# EasyEDA Pro project ProProject_Barrier Gate.epro

# Schematic Schematic1
Create Date: 2024-09-24; Page Name: P1; Project Name: Barrier Gate; Schematic Name: Schematic1; Update Date: 2024-09-28; Company: EasyEDA.com; Drawn: EasyEDA; Page Size: A4; Part Number: JLCPCB-002; Reviewed: EasyEDA; Version: V0.1
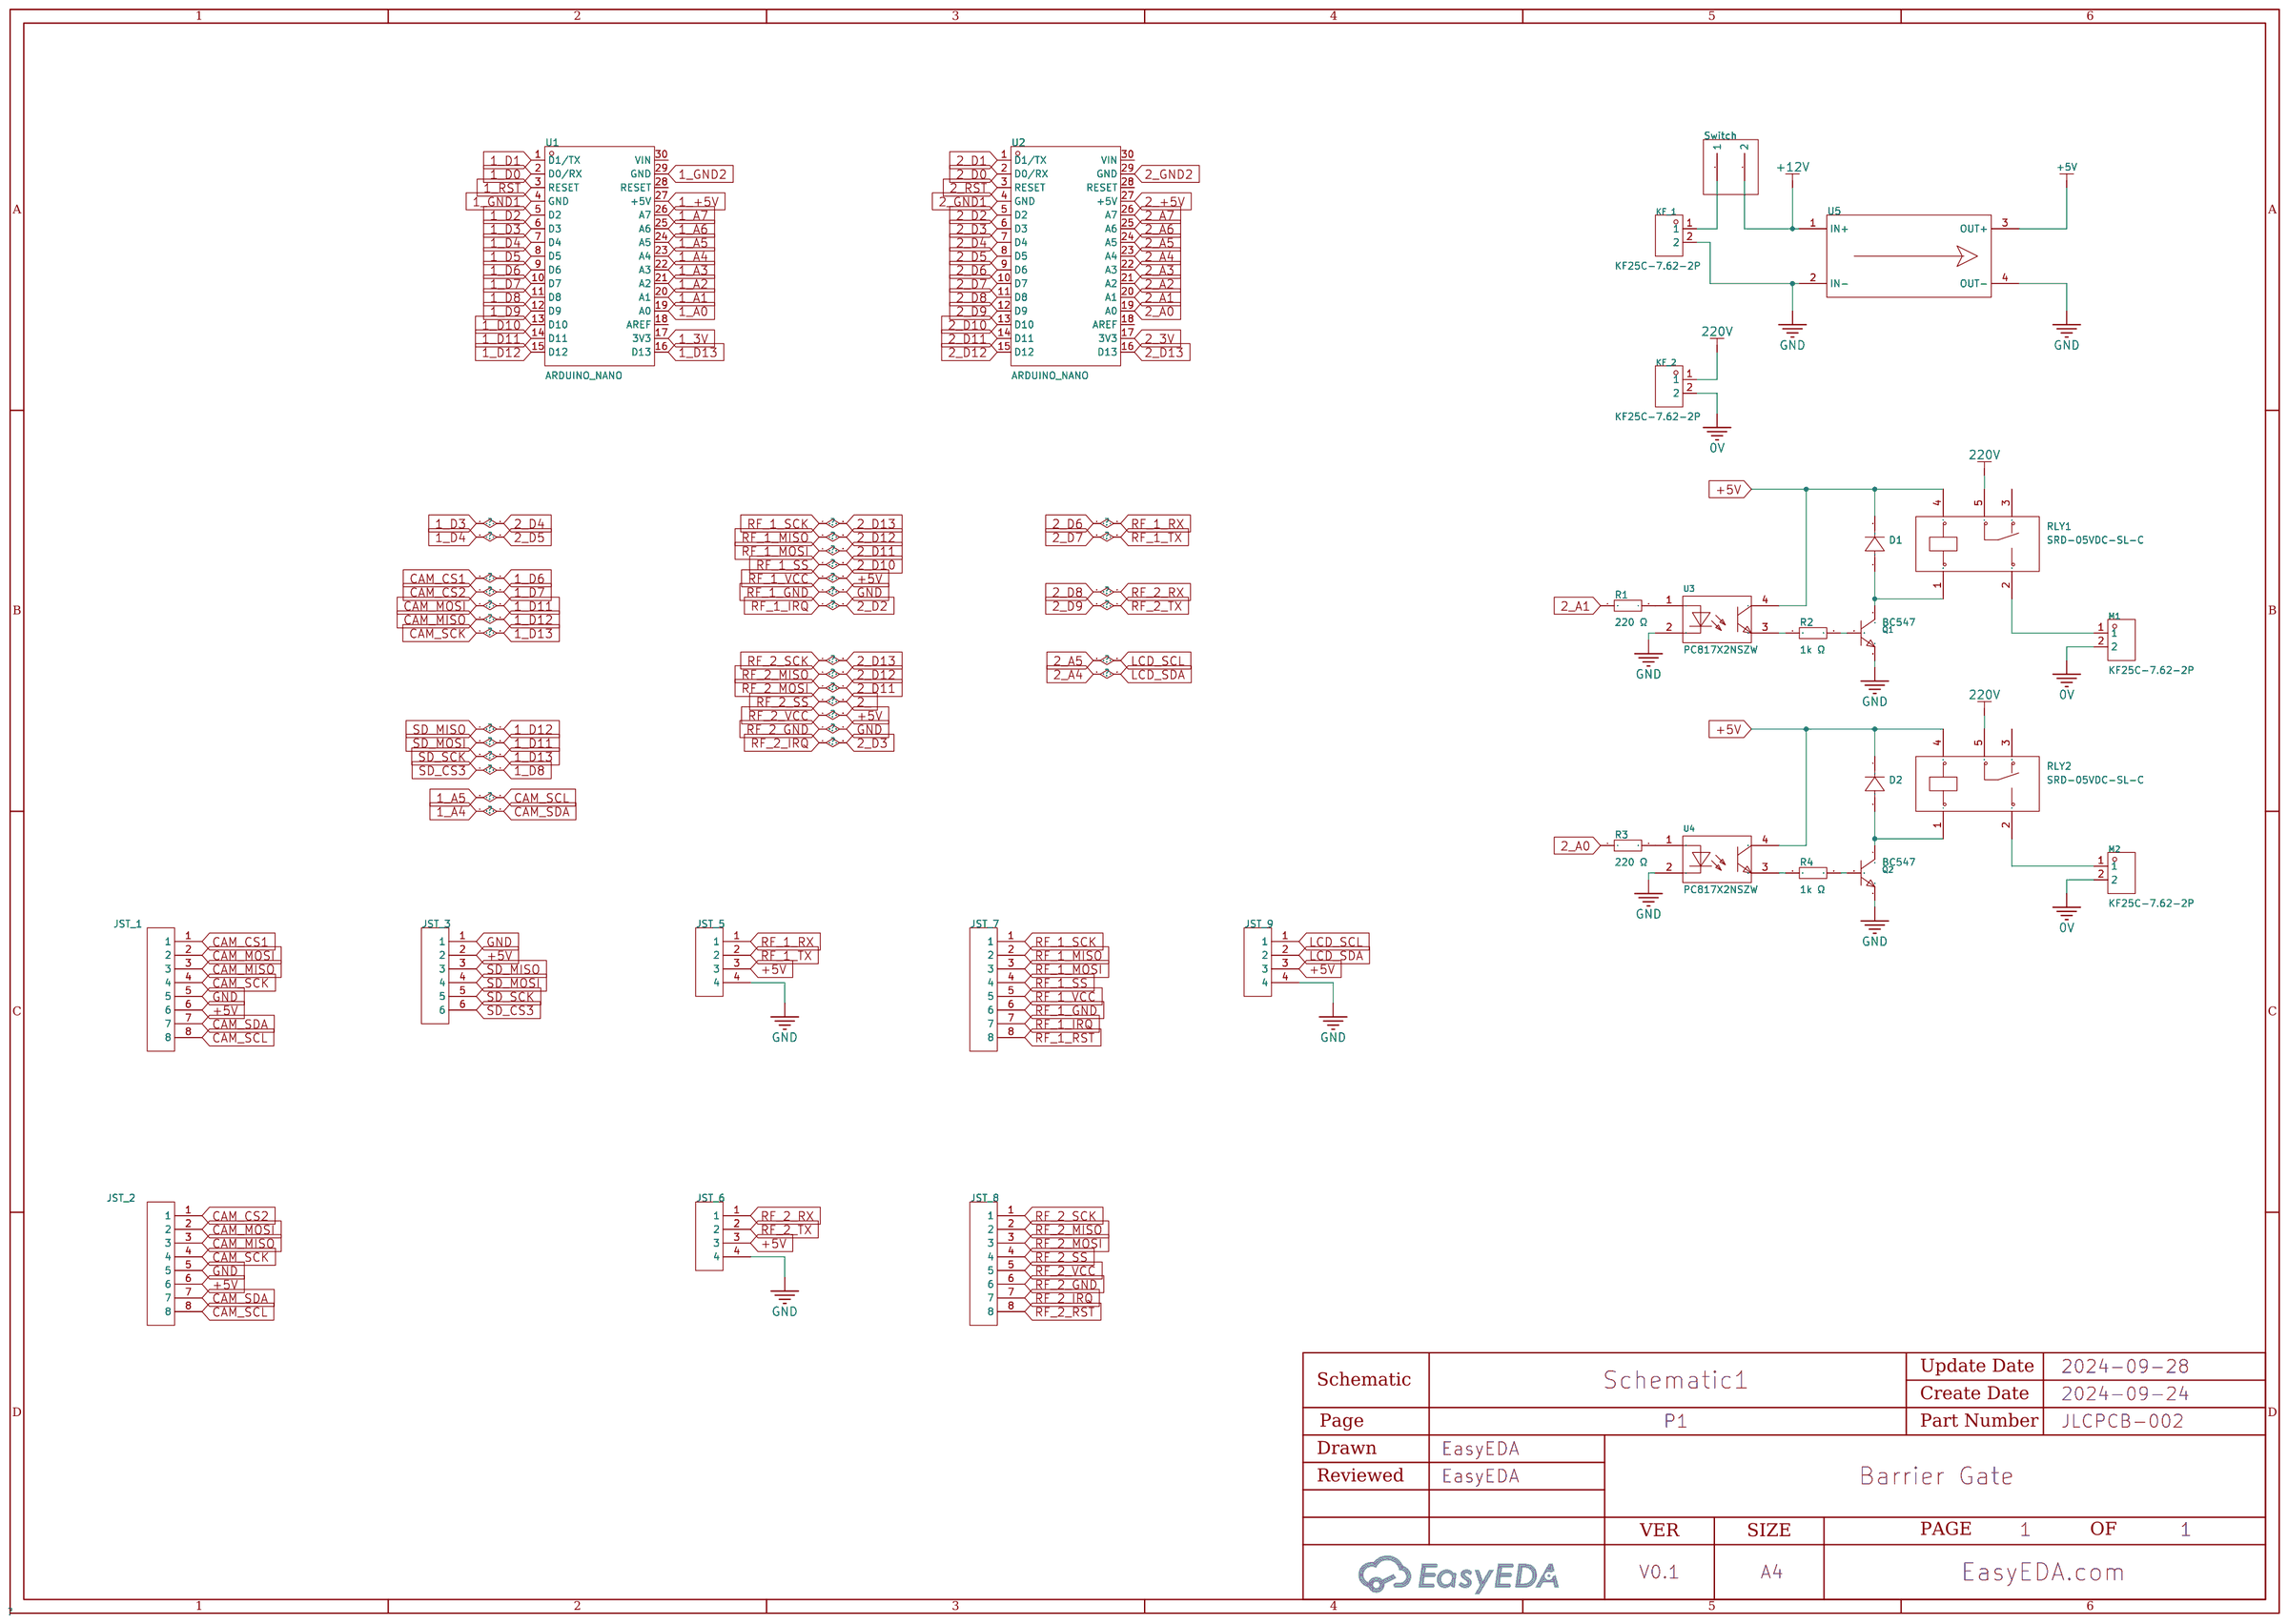
[diagram p0: schematic sheet]

## Parts
D1  -  [DO-41_BD2.4-L4.7-P8.70-D0.9-RD]
D2  -  [DO-41_BD2.4-L4.7-P8.70-D0.9-RD]
JST_1  -  [JST XH2.54 8 PIN]
JST_2  -  [JST XH2.54 8 PIN]
JST_3  -  [JST XH2.54 6 PIN]
JST_5  -  [JST XH2.54 4 PIN]
JST_6  -  [JST XH2.54 4 PIN]
JST_7  -  [JST XH2.54 8 PIN]
JST_8  -  [JST XH2.54 8 PIN]
JST_9  -  [JST XH2.54 4 PIN]
KF_1  KF25C-7.62-2P  [CONN-TH_KF25C-7.62-2P]
KF_2  KF25C-7.62-2P  [CONN-TH_KF25C-7.62-2P]
M1  KF25C-7.62-2P  [CONN-TH_KF25C-7.62-2P]
M2  KF25C-7.62-2P  [CONN-TH_KF25C-7.62-2P]
Q1  BC547  [TO-92-3_L4.9-W3.7-P1.27-L]
Q2  BC547  [TO-92-3_L4.9-W3.7-P1.27-L]
R1  220 Ω  [R_AXIAL-0.4]
R2  1k Ω  [R_AXIAL-0.4]
R3  220 Ω  [R_AXIAL-0.4]
R4  1k Ω  [R_AXIAL-0.4]
RLY1  SRD-05VDC-SL-C  [RELAY-TH_SRD-XXVDC-XL-C]
RLY2  SRD-05VDC-SL-C  [RELAY-TH_SRD-XXVDC-XL-C]
Switch  -  [JST XH2.54 2 PIN]
U1  ARDUINO_NANO  [COMM-TH_ARDUINO_NANO]
U2  ARDUINO_NANO  [COMM-TH_ARDUINO_NANO]
U3  PC817X2NSZW  [DIP-4_L6.4-W4.6-P2.54-LS7.6-BL]
U4  PC817X2NSZW  [DIP-4_L6.4-W4.6-P2.54-LS7.6-BL]
U5  -  [LM2596]

## Library data of the parts
D1 D2 = 1N4007: Supplier Footprint: DO-41
JST_1 JST_2 JST_7 JST_8 = JST XH2.54 8 PIN
JST_3 = JST XH2.54 6 PIN
JST_5 JST_6 JST_9 = JST XH2.54 4 PIN
KF_1 KF_2 M1 M2 = KF25C-7.62-2P: Barrier Type:两面 Pitch:7.62mm Structure:1x2P Mounting Style:直针 Pin Location:中脚 Number of Pins:2P Number of Rows:1 Current Rating (Max):24A Voltage Rating (Max):250V Wire Gauge - AWG:12~22 Wire Gauge - mm2:2.5 Operating Temperature Range:-40℃~+105℃ Operatin; LCSC Part Name: 7.62mm 1x2P 每排P数:2 排数:1 直针 中脚; Supplier Part: C707361; Manufacturer: KEFA(科发); Supplier Footprint: 插件,P=7.62mm; JLCPCB Part Class: Extended Part; Datasheet: https://atta.szlcsc.com/upload/public/pdf/source/20230331/03BB12528491092C95308D78C6DEF1DF.pdf; Supplier: LCSC; Barrier Type: 两面; Pitch: 7.62mm; Structure: 1x2P; Mounting Style: 直针; Pin Location: 中脚; Number of Pins: 2P; Number of Rows: 1; Current Rating (Max): 24A; Voltage Rating (Max): 250V; Wire Gauge - AWG: 12~22; Wire Gauge - mm2: 2.5; Operating Temperature Range: -40℃~+105℃; Color: Black; Number of PINs Per Row: 2
Q1 Q2 = BC547B: Transistor Type: Collector Current (Ic): Collector-Emitter Breakdown Voltage (Vceo): Power Dissipation (Pd): DC Current Gain (hFE@Ic,Vce):200@2mA,5V DC Current Gain (hFE@Ic,Vce):200@2mA,5V Transition Frequency (fT):150MHz Collector Cut-Off Current (Icbo):; LCSC Part Name: NPN 电流:100mA 耐压:45V; Supplier Part: C713613; Manufacturer: LGE(鲁光); Supplier Footprint: TO-92-3; JLCPCB Part Class: Extended Part; Datasheet: https://atta.szlcsc.com/upload/public/pdf/source/20200731/C713612_A87215DC84F647A4351B6D1248DC2A9A.pdf; Supplier: LCSC; DC Current Gain (hFE@Ic,Vce): 200@2mA,5V; Transition Frequency (fT): 150MHz; Collector Cut-Off Current (Icbo): 100nA; Collector-Emitter Saturation Voltage (VCE(sat)@Ic,Ib): 300mV@100mA,5mA
R1-R4 = Res_AXIAL-1/4W: Supplier Footprint: Through
RLY1 RLY2 = SRD-05VDC-SL-C: Coil Voltage:5V Contact Form:一组转换:1C(SPDT-转换) Pin Number:5 Contact Rating:- Maximum Switching Voltage:250V@AC Coil Rated Power:360mW Maximum Switching Current:15A Coil Type:无极性-单线圈 Coil Resistance:70Ω Contact Resistance:100mΩ Operate Time:10ms Release Tim; LCSC Part Name: 蓝色; Supplier Part: C35449; Manufacturer: 松乐; Supplier Footprint: 插件,15.6x19.2mm; JLCPCB Part Class: Extended Part; Datasheet: https://atta.szlcsc.com/upload/public/pdf/source/20200305/C490149_C96E4098A3B1FFB377D5AD2E40B7C2A8.pdf; Supplier: LCSC; Coil Voltage: 5V; Contact Form: 一组转换:1C(SPDT-转换); Pin Number: 5; Maximum Switching Voltage: 250V@AC; Coil Rated Power: 360mW; Maximum Switching Current: 15A; Coil Type: 无极性-单线圈; Coil Resistance: 70Ω; Contact Resistance: 100mΩ; Operate Time: 10ms; Release Time: 10ms
Switch = JST XH2.54 2 PIN
U1 U2 = ARDUINO_NANO: Supplier Part: C9900017879; Supplier Footprint: 插件; JLCPCB Part Class: Extended Part; Supplier: LCSC
U3 U4 = PC817X2NSZW: LCSC Part Name: PC817B  (B档) 老版; Supplier Part: C5350; Manufacturer: SHARP(夏普); Supplier Footprint: DIP-4; JLCPCB Part Class: Extended Part; Datasheet: https://atta.szlcsc.com/upload/public/pdf/source/20170919/C5350_1505799680836977608.pdf; Supplier: LCSC
U5 = LM2596

## Nets
0V: KF_2.2 M1.2 M2.2
220V: KF_2.1 RLY1.5 RLY2.5
+5V: D1.1(K) D2.1(K) JST_1.6 JST_2.6 JST_3.2 JST_5.3 JST_6.3 JST_7.5 JST_8.5 JST_9.3 RLY1.4 RLY2.4 U3.4 U4.4 U5.3(OUT+)
+12V: Switch.2 U5.1(IN+)
GND: JST_1.5 JST_2.5 JST_3.1 JST_5.4 JST_6.4 JST_7.6 JST_8.6 JST_9.4 KF_1.2 Q1.3(E) Q2.3(E) U3.2 U4.2 U5.2(IN-) U5.4(OUT-)
1_3V: U1.17(3V3)
1_+5V: U1.27(+5V)
1_A0: U1.19(A0)
1_A1: U1.20(A1)
1_A2: U1.21(A2)
1_A3: U1.22(A3)
1_A4: JST_1.7 JST_2.7 U1.23(A4)
1_A5: JST_1.8 JST_2.8 U1.24(A5)
1_A6: U1.25(A6)
1_A7: U1.26(A7)
1_D0: U1.2(D0/RX)
1_D1: U1.1(D1/TX)
1_D2: U1.5(D2)
1_D3: U1.6(D3) U2.7(D4)
1_D4: U1.7(D4) U2.8(D5)
1_D5: U1.8(D5)
1_D6: JST_1.1 U1.9(D6)
1_D7: JST_2.1 U1.10(D7)
1_D8: JST_3.6 U1.11(D8)
1_D9: U1.12(D9)
1_D10: U1.13(D10)
1_D11: JST_1.2 JST_2.2 JST_3.4 U1.14(D11)
1_D12: JST_1.3 JST_2.3 JST_3.3 U1.15(D12)
1_D13: JST_1.4 JST_2.4 JST_3.5 U1.16(D13)
1_GND1: U1.4(GND)
1_GND2: U1.29(GND)
1_RST: U1.3(RESET)
2_: JST_8.4
2_3V: U2.17(3V3)
2_+5V: U2.27(+5V)
2_A0: R3.1 U2.19(A0)
2_A1: R1.1 U2.20(A1)
2_A2: U2.21(A2)
2_A3: U2.22(A3)
2_A4: JST_9.2 U2.23(A4)
2_A5: JST_9.1 U2.24(A5)
2_A6: U2.25(A6)
2_A7: U2.26(A7)
2_D0: U2.2(D0/RX)
2_D1: U2.1(D1/TX)
2_D2: JST_7.7 U2.5(D2)
2_D3: JST_8.7 U2.6(D3)
2_D6: JST_5.1 U2.9(D6)
2_D7: JST_5.2 U2.10(D7)
2_D8: JST_6.1 U2.11(D8)
2_D9: JST_6.2 U2.12(D9)
2_D10: JST_7.4 U2.13(D10)
2_D11: JST_7.3 JST_8.3 U2.14(D11)
2_D12: JST_7.2 JST_8.2 U2.15(D12)
2_D13: JST_7.1 JST_8.1 U2.16(D13)
2_GND1: U2.4(GND)
2_GND2: U2.29(GND)
2_RST: U2.3(RESET)
RF_1_RST: JST_7.8
RF_2_RST: JST_8.8
$1N3347: D1.2(A) Q1.1(C) RLY1.1
$1N3499: Q1.2(B) R2.2
$1N3502: R2.1 U3.3
$1N3817: D2.2(A) Q2.1(C) RLY2.1
$1N3826: Q2.2(B) R4.2
$1N3828: R4.1 U4.3
$1N5241: M1.1 RLY1.2
$1N5245: M2.1 RLY2.2
$1N10805: KF_1.1 Switch.1
$1N11300: R1.2 U3.1
$1N11549: R3.2 U4.1

Not connected (* = marked no-connect by the designer): RLY1 3; RLY2 3; U1 18(AREF) 28(RESET) 30(VIN); U2 18(AREF) 28(RESET) 30(VIN)

# Board PCB1
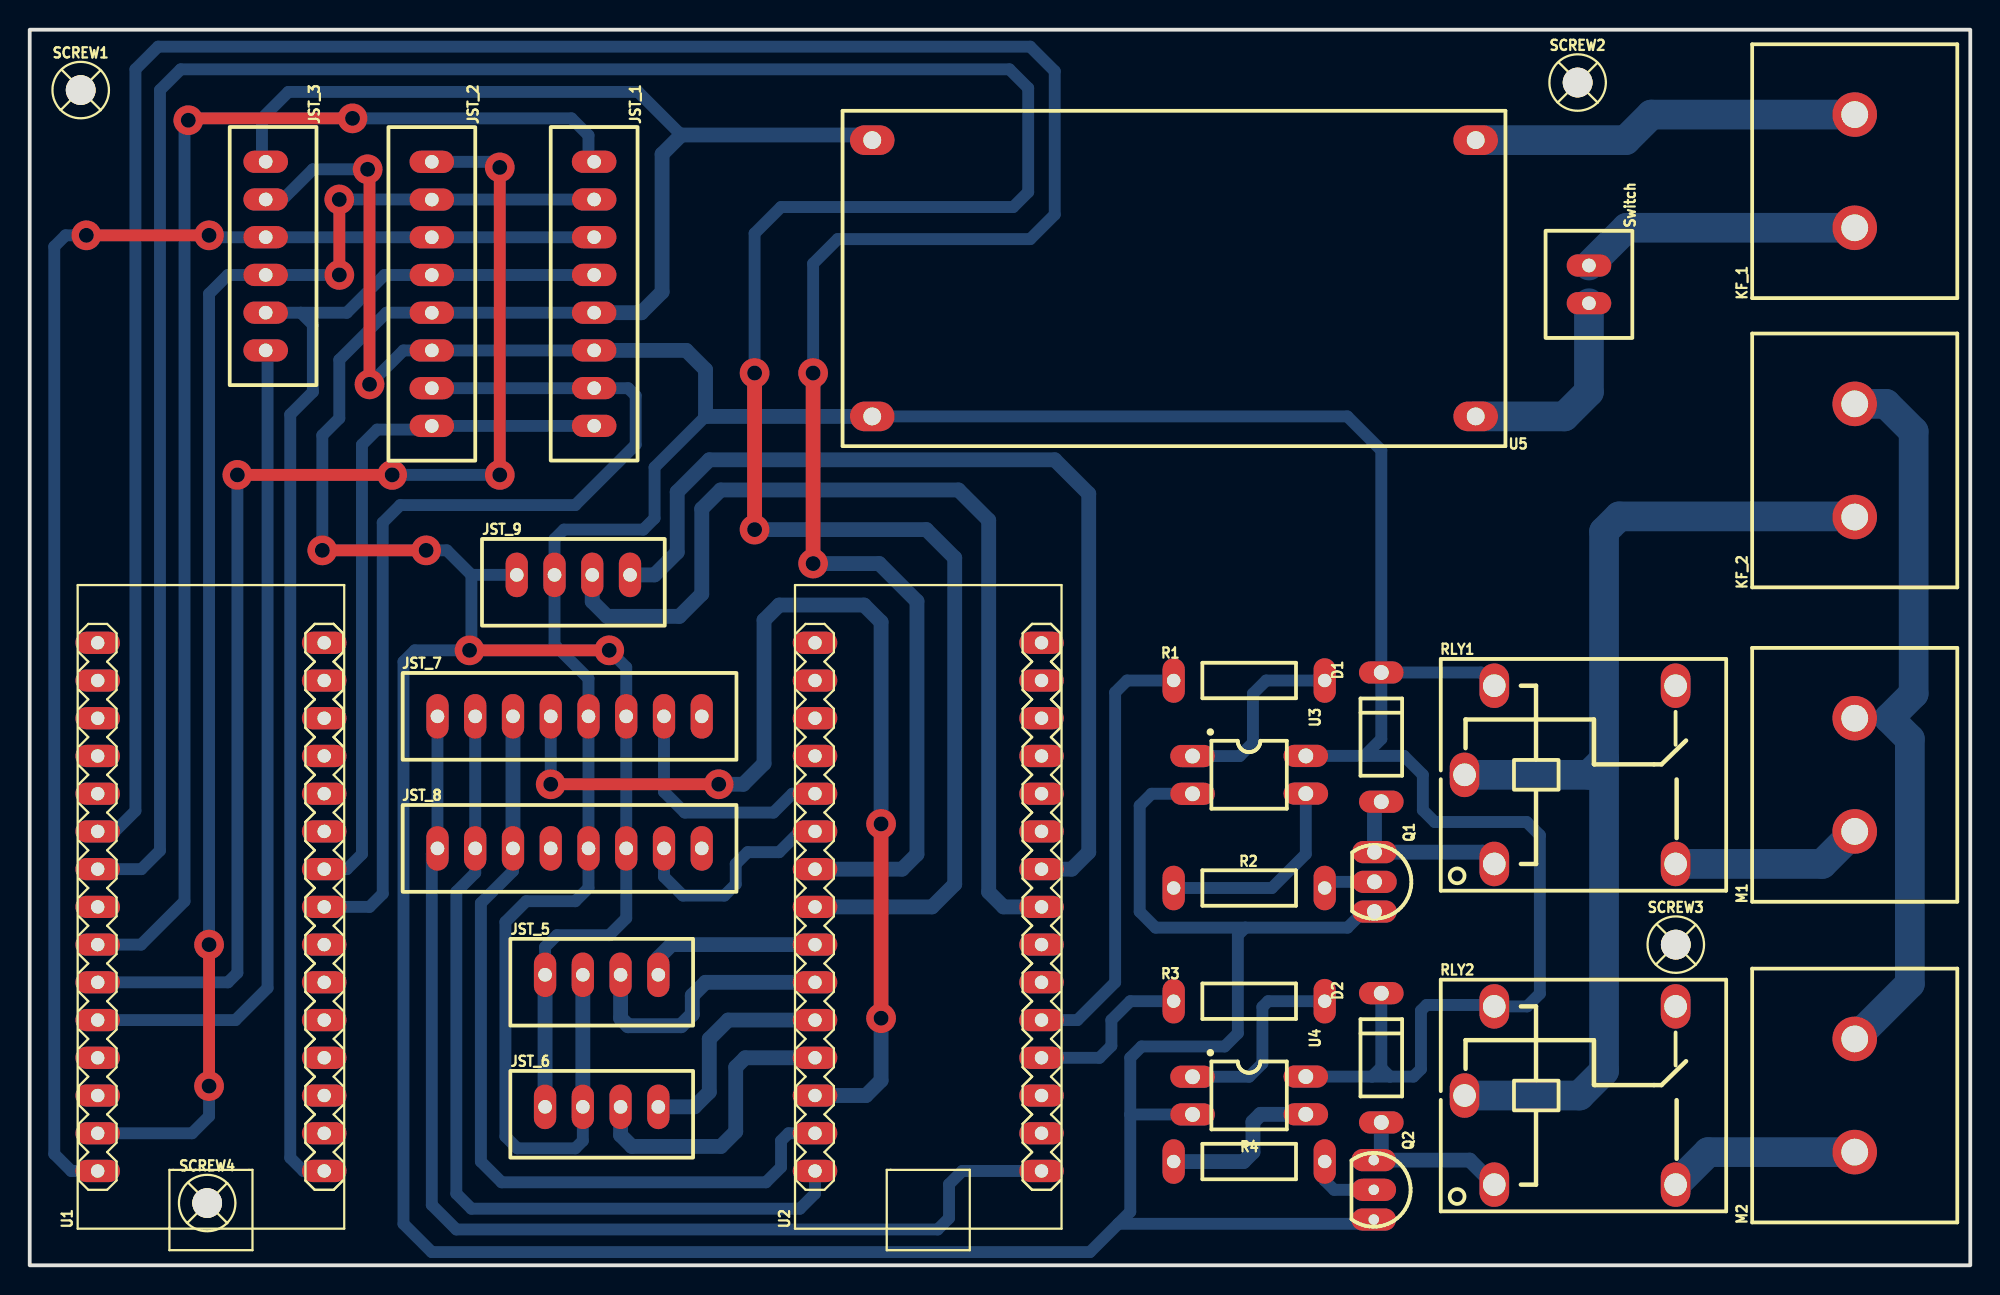
[diagram p1: board, top side]
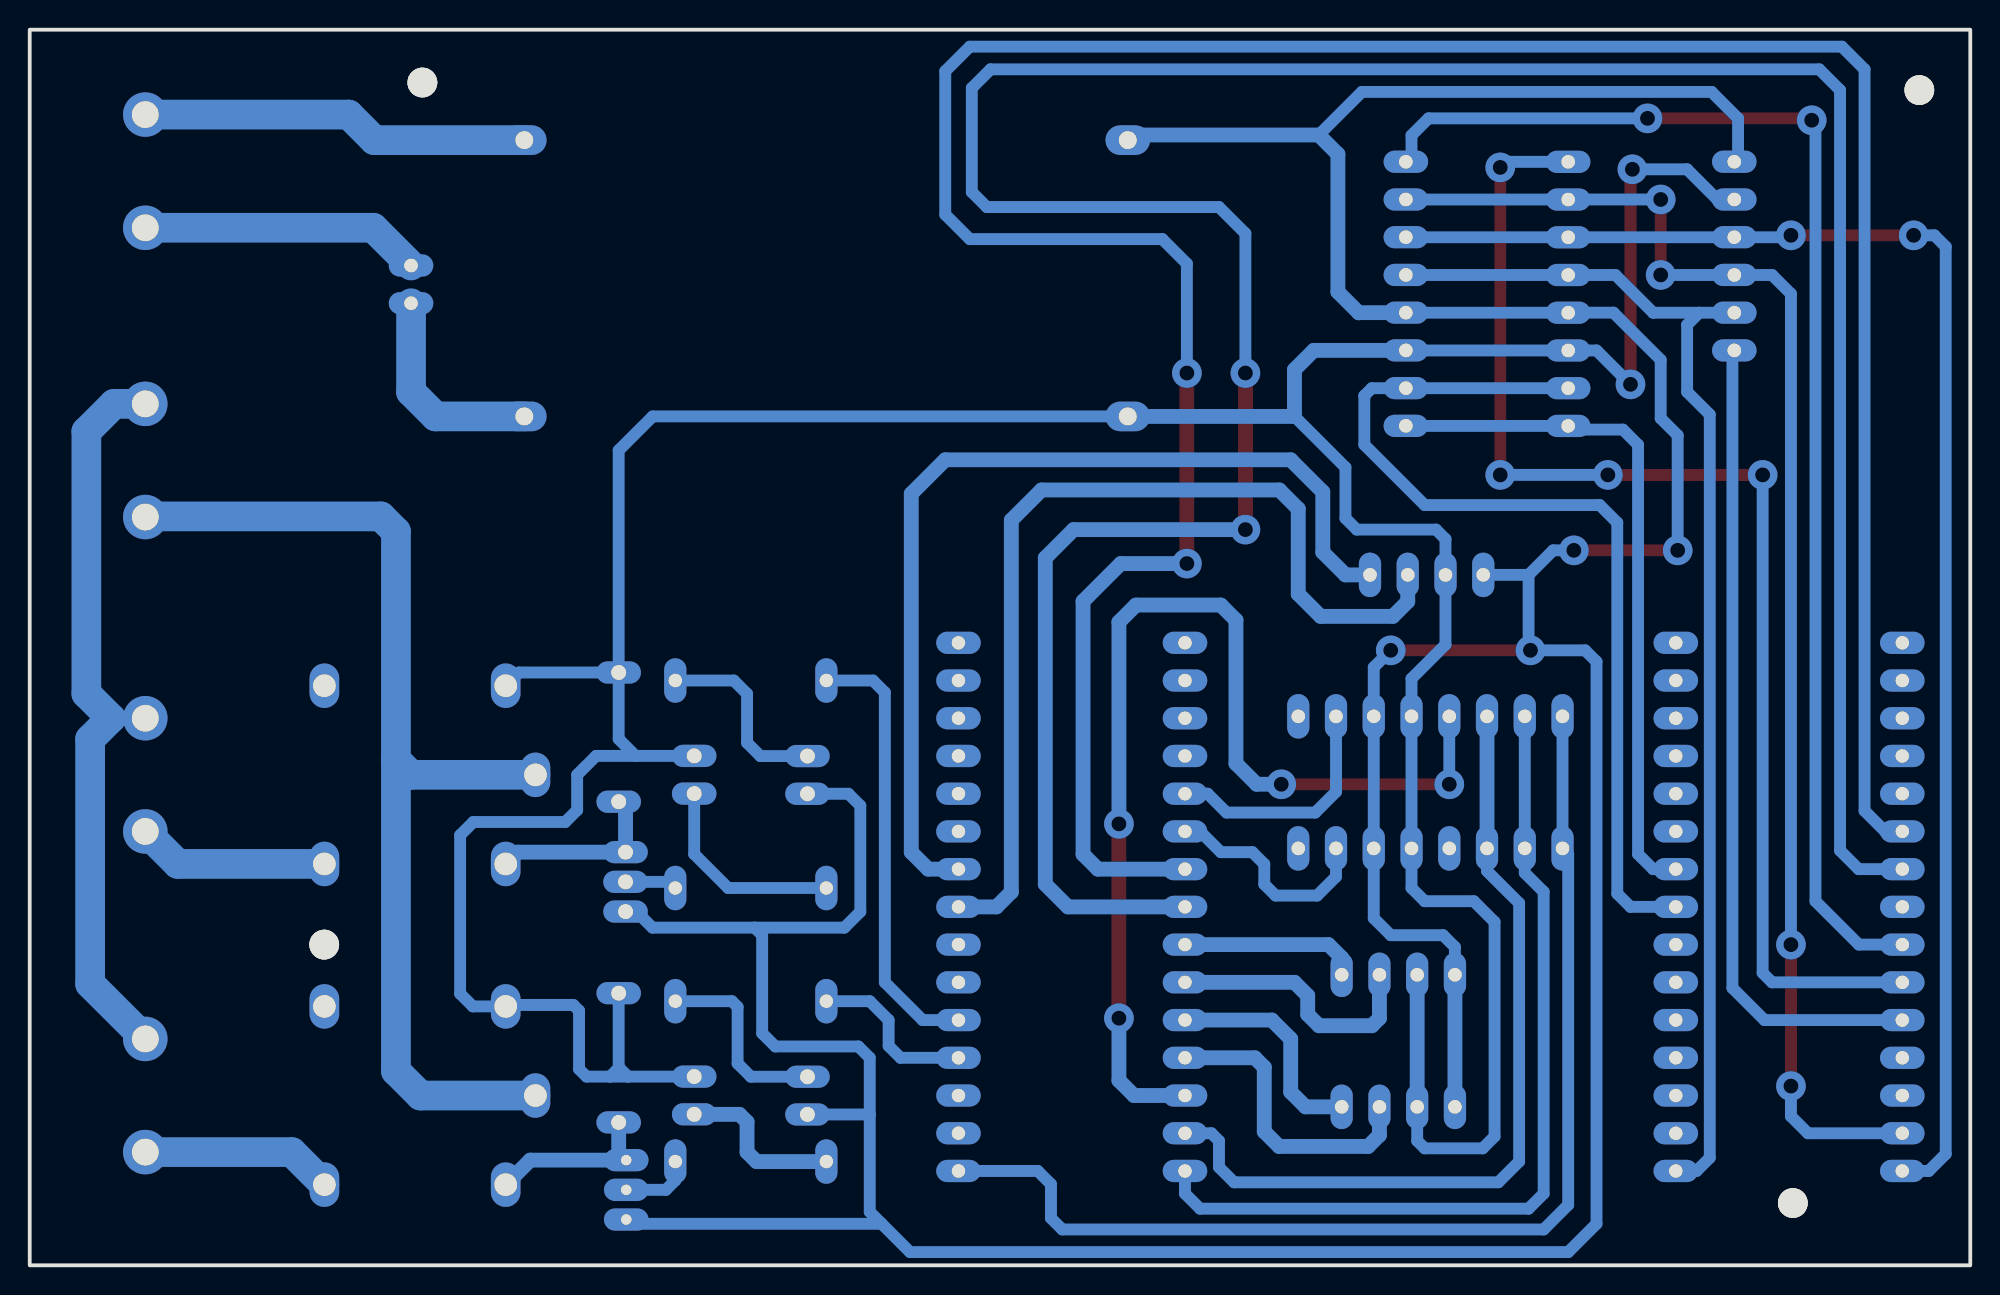
[diagram p2: board, bottom side, seen from below]

Outline 130.56 x 83.19 mm; copper layers: Top Layer, Bottom Layer. Coordinates in mm from the lower left corner of the outline.
Outline path: rectangle 0,83.19 130.56,0
Stack: Top Layer 0.035mm / Dielectric1 1.51mm FR4 er 4.5 / Bottom Layer 0.035mm

## Design rules (mm)
template: Custom Config
spacing copperThickness1oz: track to track 0.102, other pairs 0.152 to 0.3
spacing copperThickness2oz (default): track to track 0.203, other pairs 0.152 to 0.3
track width copperThickness1oz (default): min 0.8, default 0.8, max 2.54
track width copperThickness2oz: min 0.203, default 0.254, max 2.54
differential pair differentialPair (default): width min 0.127, default 0.254, max 2.54; gap min 0.152, default 0.152
via viaSize (default): diameter min 0.5, default 0.61, max 10; hole min 0.3, default 0.305, max 6.3

## Placement (name value [footprint] x y rotation side)
D1  -  [do-41_bd2.4-l4.7-p8.70-d0.9-rd]  90.93 35.56 270 top
D2  -  [do-41_bd2.4-l4.7-p8.70-d0.9-rd]  90.93 13.97 270 top
JST_1  -  [jst xh2.54 8 pin]  37.97 65.41 270 top
JST_2  -  [jst xh2.54 8 pin]  27.05 65.4 270 top
JST_3  -  [jst xh2.54 6 pin]  15.88 66.67 270 top
JST_5  -  [jst xh2.54 4 pin]  38.48 19.56 180 top
JST_6  -  [jst xh2.54 4 pin]  38.48 10.67 180 top
JST_7  -  [jst xh2.54 8 pin]  36.32 36.96 0 top
JST_8  -  [jst xh2.54 8 pin]  36.32 28.07 0 top
JST_9  -  [jst xh2.54 4 pin]  36.58 46.48 180 top
KF_1  KF25C-7.62-2P  [conn-th_kf25c-7.62-2p]  122.78 73.66 90 top
KF_2  KF25C-7.62-2P  [conn-th_kf25c-7.62-2p]  122.78 54.19 90 top
M1  KF25C-7.62-2P  [conn-th_kf25c-7.62-2p]  122.78 33.02 90 top
M2  KF25C-7.62-2P  [conn-th_kf25c-7.62-2p]  122.78 11.43 90 top
Q1  BC547  [to-92-3_l4.9-w3.7-p1.27-l#2]  90.47 25.82 270 top
Q2  BC547  [to-92-3_l4.9-w3.7-p1.27-l]  90.42 5.08 270 top
R1  220 Ω  [r_axial-0.4]  82.04 39.37 0 top
R2  1k Ω  [r_axial-0.4]  82.04 25.4 0 top
R3  220 Ω  [r_axial-0.4]  82.04 17.78 0 top
R4  1k Ω  [r_axial-0.4]  82.04 6.99 0 top
RLY1  SRD-05VDC-SL-C  [relay-th_srd-xxvdc-xl-c]  103.63 33.02 0 top
RLY2  SRD-05VDC-SL-C  [relay-th_srd-xxvdc-xl-c]  103.63 11.43 0 top
SCREW1  -  [Screw-Hole-M2]  3.43 79.12 0 top
SCREW2  -  [Screw-Hole-M2]  104.14 79.63 0 top
SCREW3  -  [Screw-Hole-M2]  110.74 21.59 0 top
SCREW4  -  [Screw-Hole-M2]  11.94 4.19 0 top
Switch  -  [jst xh2.54 2 pin]  104.9 66.04 270 top
U1  ARDUINO_NANO  [comm-th_arduino_nano]  12.19 24.13 90 top
U2  ARDUINO_NANO  [comm-th_arduino_nano]  60.45 24.13 90 top
U3  PC817X2NSZW  [dip-4_l6.4-w4.6-p2.54-ls7.6-bl]  82.04 33.02 270 top
U4  PC817X2NSZW  [dip-4_l6.4-w4.6-p2.54-ls7.6-bl]  82.04 11.43 270 top
U5  -  [lm2596]  97.28 57.15 180 top

## Footprints (pads in the part's own frame, mm; a bottom-side part is the same pattern mirrored in y, then rotated)
comm-th_arduino_nano
  oval 1.5x3 hole 0.9: 1(17.78,7.62) 2(15.24,7.62) 3(12.7,7.62) 4(10.16,7.62) 5(7.62,7.62) 6(5.08,7.62) 7(2.54,7.62) 8(0,7.62) 9(-2.54,7.62) 10(-5.08,7.62) 11(-7.62,7.62) 12(-10.16,7.62) 13(-12.7,7.62) 14(-15.24,7.62) 15(-17.78,7.62) 16(-17.78,-7.62) 17(-15.24,-7.62) 18(-12.7,-7.62) 19(-10.16,-7.62) 20(-7.62,-7.62) 21(-5.08,-7.62) 22(-2.54,-7.62) 23(0,-7.62) 24(2.54,-7.62) 25(5.08,-7.62) 26(7.62,-7.62) 27(10.16,-7.62) 28(12.7,-7.62) 29(15.24,-7.62) 30(17.78,-7.62)
conn-th_kf25c-7.62-2p
  round 3 hole 1.8: 1(-3.81,0) 2(3.81,0)
dip-4_l6.4-w4.6-p2.54-ls7.6-bl
  oval 1.5x3 hole 1: 1(-1.265,-3.81) 2(1.275,-3.81) 3(1.265,3.81) 4(-1.275,3.81)
do-41_bd2.4-l4.7-p8.70-d0.9-rd
  oval 1.5x3 hole 1: 1(-4.35,0) 2(4.35,0)
jst xh2.54 2 pin
  oval 1.5x3 hole 0.914: 1(-1.27,0) 2(1.27,0)
jst xh2.54 4 pin
  oval 1.5x3 hole 0.914: 1(-3.81,0) 2(-1.27,0) 3(1.27,0) 4(3.81,0)
jst xh2.54 6 pin
  oval 1.5x3 hole 0.914: 1(-7.62,0) 2(-5.08,0) 3(-2.54,0) 4(0,0) 5(2.54,0) 6(5.08,0)
jst xh2.54 8 pin
  oval 1.5x3 hole 0.914: 1(-8.89,0) 2(-6.35,0) 3(-3.81,0) 4(-1.27,0) 5(1.27,0) 6(3.81,0) 7(6.35,0) 8(8.89,0)
lm2596
  oval 3x2 hole 1.199: 1(0.001,-0.001) 2(0,-18.6) 3(40.6,0) 4(40.6,-18.6)
r_axial-0.4
  oval 1.5x3 hole 0.899: 1(-5.08,0) 2(5.08,0)
relay-th_srd-xxvdc-xl-c
  oval 2x3 hole 1.524: 1(-5.1,-6) 2(7.1,-6) 3(7.1,6) 4(-5.1,6) 5(-7.1,0)
Screw-Hole-M2
  round 2 hole 2: 1(0,0)
to-92-3_l4.9-w3.7-p1.27-l
  oval 1.5x3 hole 0.7: 1(-2,0) 2(0,0) 3(2,0)
to-92-3_l4.9-w3.7-p1.27-l#2
  oval 1.5x3 hole 1: 1(-2,0) 2(0,0) 3(2.001,0)

## Nets
As in the schematic.

Pads without a net: RLY1 3; RLY2 3; SCREW1 1; SCREW2 1; SCREW3 1; SCREW4 1; U1 18 28 30; U2 18 28 30

## Via types
v1: diameter 2, hole 1, Top Layer to Bottom Layer, 26 vias

## Routing (per net, layer and track width the routed paths; a pad name or vN(x,y) marks a point on that pad's centre or on a via; arc(x,y) is an arc through that point)
0V: length 50.7
  Bottom Layer w0.8: 125.09,36.83 M1.2
  Bottom Layer w2: KF_2.2 124.88,58 126.75,56.13 126.75,38.49 125.09,36.83 126.49,35.43 126.49,18.95 M2.2
220V: length 73.5
  Bottom Layer w2: 105.92,34.04 105.92,49.4 106.93,50.42 122.74,50.42 KF_2.1 ; 105.92,34.04 105.92,13.08 104.27,11.43 RLY2.5 ; 105.92,34.04 104.9,33.02 RLY1.5
+5V: length 260.3
  Top Layer w0.8: v1(22.73,73.79) 22.86,73.66 v1(22.86,59.31)
  Bottom Layer w0.8: JST_6.3 37.21,8.38 36.7,7.87 32.8,7.87 32,8.67 32,23.11 33.4,24.51 36.7,24.51 37.59,25.4 JST_8.5 JST_7.5 37.59,39.5 35.31,41.78 JST_9.3 35.31,48.89 35.94,49.53 41.27,49.53 42.04,50.29 42.04,53.72 45.47,57.15 ; 90.93,13.34 90.93,13.29 91.51,12.71 ; 90.93,13.34 90.93,18.32 ; 90.93,13.34 90.3,12.71 ; v1(22.73,73.79) 19.05,73.79 17.01,71.75 15.62,71.75 ; 89.79,34.3 90.93,35.43 D1.1 ; 89.79,34.3 U3.4 ; 89.79,34.3 92.45,34.3 93.73,33.02 93.73,30.64 94.53,29.84 100.71,29.84 101.6,28.96 101.6,18.29 100.74,17.43 RLY2.4 98.44,17.53 93.98,17.53 93.6,17.14 93.6,13.21 93.1,12.71 91.51,12.71 ; RLY1.4 97.64,39.91 D1.1 ; D1.1 90.93,54.86 88.65,57.15 U5.3 ; 90.3,12.71 U4.4 ; 90.3,12.71 91.51,12.71 ; v1(22.86,59.31) 25.14,61.59 JST_2.6 37.59,61.59 37.59,61.59
  Bottom Layer w1: U5.3 45.47,57.15 45.47,60.3 44.17,61.59 37.59,61.59 ; JST_6.3 JST_5.3
+12V: length 14.3
  Bottom Layer w2: U5.1 103.25,57.15 104.9,58.8 104.9,64.77
GND: length 352.6
  Top Layer w0.8: v1(26.67,48.13) v1(19.69,48.13) ; v1(29.59,41.4) v1(38.99,41.4)
  Bottom Layer w0.8: v1(38.99,41.4) 40.13,40.26 JST_7.6 JST_8.6 40.13,23.37 38.99,22.22 35.47,22.22 34.67,21.42 JST_5.4 ; 43.83,76.1 40.94,78.99 17.4,78.99 15.62,77.22 15.62,74.29 ; U4.2 74.04,10.16 ; 74.04,10.16 74.04,13.97 74.8,14.73 80.39,14.73 81.28,15.62 81.28,22.22 81.79,22.73 ; 74.04,10.16 74.04,3.6 73.23,2.79 ; 81.79,22.73 75.75,22.73 74.68,23.81 74.68,30.95 75.48,31.75 U3.2 ; 81.79,22.73 88.66,22.73 89.74,23.81 Q1.3 ; 90.42,3.3 89.92,2.79 73.23,2.79 ; v1(26.67,48.13) 28.06,48.13 29.71,46.48 ; 73.23,2.79 71.33,0.89 27.05,0.89 25.15,2.79 25.15,40.64 25.91,41.4 29.2,41.4 29.59,41.79 ; 37.59,64.14 37.59,64.13 27.05,64.13 27.05,64.14 24,64.14 20.83,60.96 20.83,57.02 19.69,55.88 v1(19.69,48.13) ; 29.71,46.48 JST_9.4 ; 29.71,46.48 29.71,41.91 29.59,41.79 ; 29.59,41.79 v1(29.59,41.4)
  Bottom Layer w1: JST_5.4 JST_6.4 ; 37.59,64.14 41.14,64.14 41.14,64.13 42.55,65.53 42.55,74.81 43.83,76.1 56.34,76.1 U5.4
  Bottom Layer w2: KF_1.2 109.09,77.47 107.37,75.75 U5.2
1_A4: length 65.7
  Bottom Layer w0.8: 27.05,59.05 40.26,59.05 40.77,58.55 40.77,55.25 36.7,51.18 24.93,51.18 23.75,50 23.75,25.02 22.86,24.13 U1.23
1_A5: length 46.3
  Bottom Layer w0.8: 37.59,56.52 37.59,56.51 JST_2.8 26.8,56.26 23.37,56.26 22.35,55.25 22.35,27.69 21.34,26.67 U1.24
1_D3: length 196
  Top Layer w1: v1(52.7,47.24) v1(52.7,60.07)
  Bottom Layer w0.8: U1.6 5.72,29.21 7.11,30.6 7.11,80.52 8.64,82.04 67.31,82.04 68.96,80.39 68.96,70.74 67.31,69.09 54.36,69.09 52.7,67.44 v1(52.7,60.07)
  Bottom Layer w1: U2.7 58.69,26.67 59.69,27.67 59.69,44.7 57.15,47.24 v1(52.7,47.24)
1_D4: length 208.2
  Top Layer w1: v1(48.77,49.53) v1(48.77,60.07)
  Bottom Layer w0.8: v1(48.77,60.07) 48.77,69.47 50.55,71.25 66.17,71.25 67.17,72.25 67.17,79.26 65.91,80.52 10.16,80.52 8.76,79.12 8.76,27.92 7.51,26.67 U1.7
  Bottom Layer w1: v1(48.77,49.53) 60.33,49.53 62.23,47.62 62.23,25.65 60.71,24.13 U2.8
1_D6: length 89
  Top Layer w0.8: v1(10.67,77.09) 10.8,77.22 v1(21.72,77.22)
  Bottom Layer w0.8: U1.9 7.49,21.59 10.41,24.51 10.41,76.84 v1(10.67,77.09) ; 37.59,74.3 37.59,76.07 36.45,77.22 v1(21.72,77.22)
1_D7: length 86.3
  Top Layer w0.8: v1(13.97,53.21) v1(24.38,53.21) ; v1(31.62,73.91) v1(31.62,53.21)
  Bottom Layer w0.8: v1(31.62,53.21) v1(24.38,53.21) ; U1.10 13.33,19.05 13.97,19.69 v1(13.97,53.21) ; v1(31.62,73.91) 31.25,74.29 JST_2.1
1_D8: length 55.4
  Bottom Layer w0.8: 15.62,61.59 16,61.21 16,18.67 13.84,16.51 U1.11
1_D11: length 94.9
  Top Layer w0.8: v1(12.06,12.06) v1(12.06,21.59) ; v1(20.83,66.67) v1(20.83,71.75)
  Bottom Layer w0.8: v1(12.06,21.59) 12.06,65.41 13.33,66.67 20.82,66.67 v1(20.83,66.67) ; v1(20.83,71.75) 27.05,71.75 JST_2.2 37.97,71.75 JST_1.2 ; v1(12.06,12.06) 12.06,10.03 10.92,8.89 U1.14
1_D12: length 101.2
  Top Layer w0.8: v1(12.06,69.34) v1(3.81,69.34)
  Bottom Layer w0.8: U1.15 2.79,6.35 1.65,7.49 1.65,68.58 2.41,69.34 v1(3.81,69.34) ; v1(12.06,69.34) 12.2,69.21 JST_2.3 37.97,69.21 JST_1.3
1_D13: length 83.9
  Bottom Layer w0.8: U1.16 18.41,6.35 17.53,7.24 17.53,57.28 19.05,58.8 19.05,63.32 18.24,64.13 ; JST_1.4 37.97,66.67 JST_2.4 23.87,66.67 21.33,64.13 18.24,64.13 ; 18.24,64.13 15.62,64.13
2_A0: length 11.5
  Bottom Layer w0.8: U2.19 71.97,13.97 72.77,14.77 72.77,16.51 74.04,17.78 R3.1
2_A1: length 29.8
  Bottom Layer w0.8: U2.20 70.48,16.51 73.02,19.05 73.02,38.57 73.83,39.37 R1.1
2_A4: length 65.6
  Bottom Layer w1: U2.23 65.52,24.13 64.52,25.13 64.52,50.17 62.48,52.2 46.48,52.2 45.21,50.93 45.21,45.2 43.7,43.69 38.85,43.69 37.85,44.69 JST_9.2
2_A5: length 65.2
  Bottom Layer w1: U2.24 70.1,26.67 71.25,27.81 71.25,51.94 68.96,54.23 45.72,54.23 43.56,52.07 43.56,48.01 42.04,46.48 JST_9.1
2_D2: length 16.3
  Bottom Layer w0.8: JST_7.7 42.67,31.88 44.07,30.48 50.04,30.48 51.31,31.75 U2.5
2_D3: length 15.2
  Bottom Layer w0.8: U2.6 51.82,29.21 50.42,27.81 48.3,27.81 47.5,27.01 47.5,25.65 46.74,24.89 43.94,24.89 42.67,26.16 JST_8.7
2_D6: length 12.1
  Bottom Layer w1: JST_5.1 42.29,20.7 43.18,21.59 U2.9
2_D7: length 18.2
  Bottom Layer w1: JST_5.2 39.75,16.64 40.26,16.13 43.81,16.13 44.58,16.89 44.58,18.16 45.47,19.05 U2.10
2_D8: length 15.1
  Bottom Layer w1: U2.11 46.99,16.51 45.72,15.24 45.72,11.67 44.72,10.67 JST_6.1
2_D9: length 20.3
  Bottom Layer w1: U2.12 48.13,13.97 47.5,13.34 47.5,9 46.5,8 40.51,8 39.75,8.76 JST_6.2
2_D10: length 73.6
  Top Layer w0.8: v1(46.36,32.39) v1(35.05,32.39)
  Top Layer w1: v1(57.28,16.64) v1(57.28,29.72)
  Bottom Layer w0.8: v1(35.05,32.39) JST_7.4
  Bottom Layer w1: v1(57.28,29.72) 57.28,43.31 56.13,44.45 50.42,44.45 49.4,43.43 49.4,33.78 48.01,32.39 v1(46.36,32.39) ; v1(57.28,16.64) 57.28,12.45 56.26,11.43 U2.13
2_D11: length 56.3
  Bottom Layer w0.8: JST_8.3 32.51,26.54 30.35,24.38 30.35,6.99 31.75,5.59 49.53,5.59 50.55,6.6 50.55,8.38 51.05,8.89 U2.14
  Bottom Layer w1: JST_7.3 JST_8.3
2_D12: length 59.2
  Bottom Layer w0.8: U2.15 52.83,4.83 51.82,3.81 29.72,3.81 28.7,4.83 28.7,25.15 29.97,26.42 JST_8.2 JST_7.2
2_D13: length 77.7
  Bottom Layer w0.8: JST_7.1 JST_8.1 27.05,27.69 27.05,4.06 28.7,2.41 61.09,2.41 61.85,3.18 61.85,5.46 62.74,6.35 U2.16
$1N3347: length 12
  Bottom Layer w1: RLY1.1 97.74,27.81 Q1.1 90.47,30.75 D1.2
$1N3499: length 3.5
  Bottom Layer w0.8: Q1.2 87.54,25.82 R2.2
$1N3502: length 13.9
  Bottom Layer w0.8: U3.3 85.85,27.69 83.57,25.4 R2.1
$1N3817: length 11.5
  Bottom Layer w1: RLY2.1 96.88,7.08 Q2.1 90.93,7.59 D2.2
$1N3826: length 4.8
  Bottom Layer w0.8: R4.2 87.12,5.72 87.76,5.08 Q2.2
$1N3828: length 11.4
  Bottom Layer w1: R4.1 81.66,6.99 82.3,7.62 82.3,9.65 82.8,10.16 85.85,10.16 U4.3
$1N5241: length 13
  Bottom Layer w2: M1.1 120.59,27.02 RLY1.2
$1N5245: length 13
  Bottom Layer w2: RLY2.2 112.92,7.62 M2.1
$1N10805: length 18.9
  Bottom Layer w2: Switch.1 107.44,69.85 KF_1.1
$1N11300: length 12.9
  Bottom Layer w0.8: R1.2 83.18,39.37 82.3,38.48 82.3,35.18 81.4,34.28 U3.1
$1N11549: length 13.2
  Bottom Layer w0.8: R3.2 83.32,17.78 82.93,17.39 82.93,13.59 82.04,12.69 U4.1
